# Altium project shaolollc-usb_breakout_miniusb.PrjPcb
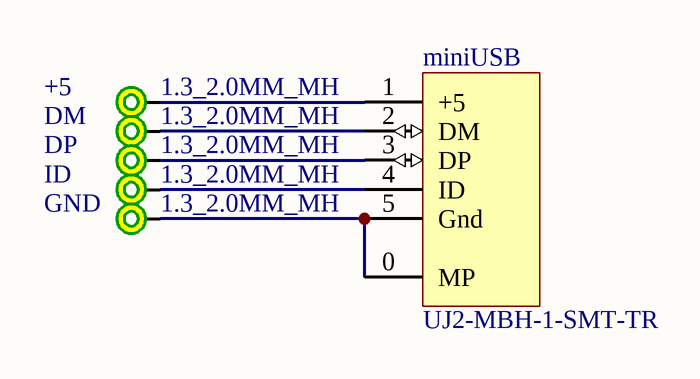
[diagram p0: main_miniusb.SchDoc]
prj_ProjectName: shaolollc-usb_breakout_miniusb; prj_ProjectRevision: Rev. 1; prj_ProjectSerialNumber: xxx-xxxxx
1 sheet, 6 parts. Net scope: global (net labels, ports and power ports of the same name join across sheets).
Board file: shaolollc-usb_breakout_miniusb.PcbDoc

## Sheet main_miniusb.SchDoc: Tools >Doc Options > Parameters > Title
size 431 x 279 mm; Author: Tools >Doc Options > Parameters; CompanyName: Tools >Doc Options > Parameters; Engineer: Tools >Doc Options > Parameters; Organization: Tools >Doc Options > Parameters; Address1: Tools >Doc Options > Parameters; Address2: Tools >Doc Options > Parameters; Address3: Tools >Doc Options > Parameters; Address4: Tools >Doc Options > Parameters; SheetSize: 11x17; PageSetup: Record=PageOptions|CenterHorizontal=True|CenterVertical=True|PrintScale=0.94|XCorrection=1.00|YCorrection=1.00|PrintKind=0|BorderSize=5000000|LeftOffset=0|BottomOffset=0|Orientation=2|PaperLength=1000|PaperWidth=1000|Scale=100|PaperSource=257|PrintQuality=600|MediaType=1|DitherType=10|PaperKind=11x17|PrintScaleMode=1

### Parts
+5  value 1.3_2.0MM_MH  [1.3_2.0MM_PH]  (no BOM)
DM  value 1.3_2.0MM_MH  [1.3_2.0MM_PH]  (no BOM)
DP  value 1.3_2.0MM_MH  [1.3_2.0MM_PH]  (no BOM)
GND  value 1.3_2.0MM_MH  [1.3_2.0MM_PH]  (no BOM)
ID  value 1.3_2.0MM_MH  [1.3_2.0MM_PH]  (no BOM)
miniUSB  value UJ2-MBH-1-SMT-TR  [USB MINI B W PEGS - UJ2]

### Nets
Net+5_1: +5.1 miniUSB.1(+5)
NetDM_1: DM.1 miniUSB.2(DM)
NetDP_1: DP.1 miniUSB.3(DP)
NetGND_1: GND.1 miniUSB.0(MP) miniUSB.5(Gnd)
NetID_1: ID.1 miniUSB.4(ID)

### Notes on the sheet
- Title
- CONFIDENTIAL
- Project Name:
- Size:
- Date:
- Variant:
- Number:
- Time:
- File:
- Revision:
- Sheet
- of
- Engineer(s):

### Library data of the parts
+5 DM DP GND ID = PCB_0092: 1.3_2.0MM_MH; Manufacturer: Misc PCB; Manufacturer Part Number: S46; Reviewer: shawn@shaolo.com; ClassName: Plated Holes; Part Number: PCB_0092; UID: 61; RoHS: True; ComponentLink1Description: Manufacturer URL; ComponentLink1URL: 0; ComponentLink2Description: Datasheet URL; ComponentLink3Description: Package URL; Supplier 1: ShaoloLLC; Published: 1/20/2015; Publisher: shawn@shaolo.com
miniUSB = CONN_0247: USB JACK 2.0, MINI B TYPE, 5 PIN; Manufacturer: Cui; Reviewer: shawn@shaolo.com; Conductors: 5; Gender?: Female; SMT?: True; Part Number: CONN_0247; UID: 246; Manufacturer Part Number: UJ2-MBH-1-SMT-TR; RoHS: True; HelpURL: https://www.cui.com/product/resource/digikeypdf/uj2-mbh-smt.pdf; ComponentLink1Description: Manufacturer URL; ComponentLink1URL: 0; ComponentLink2Description: Datasheet URL; ComponentLink3Description: Package URL; Supplier 1: Digi-Key; Supplier Part Number 1: 102-4003-1-ND; Published: 4/1/2018; Publisher: shawn@shaolo.com; Orientation: RA; Reflow?: True